# Altium schematic sheet Power.SchDoc
size 259 x 167 mm; SheetNumber: 2; SheetTotal: 2
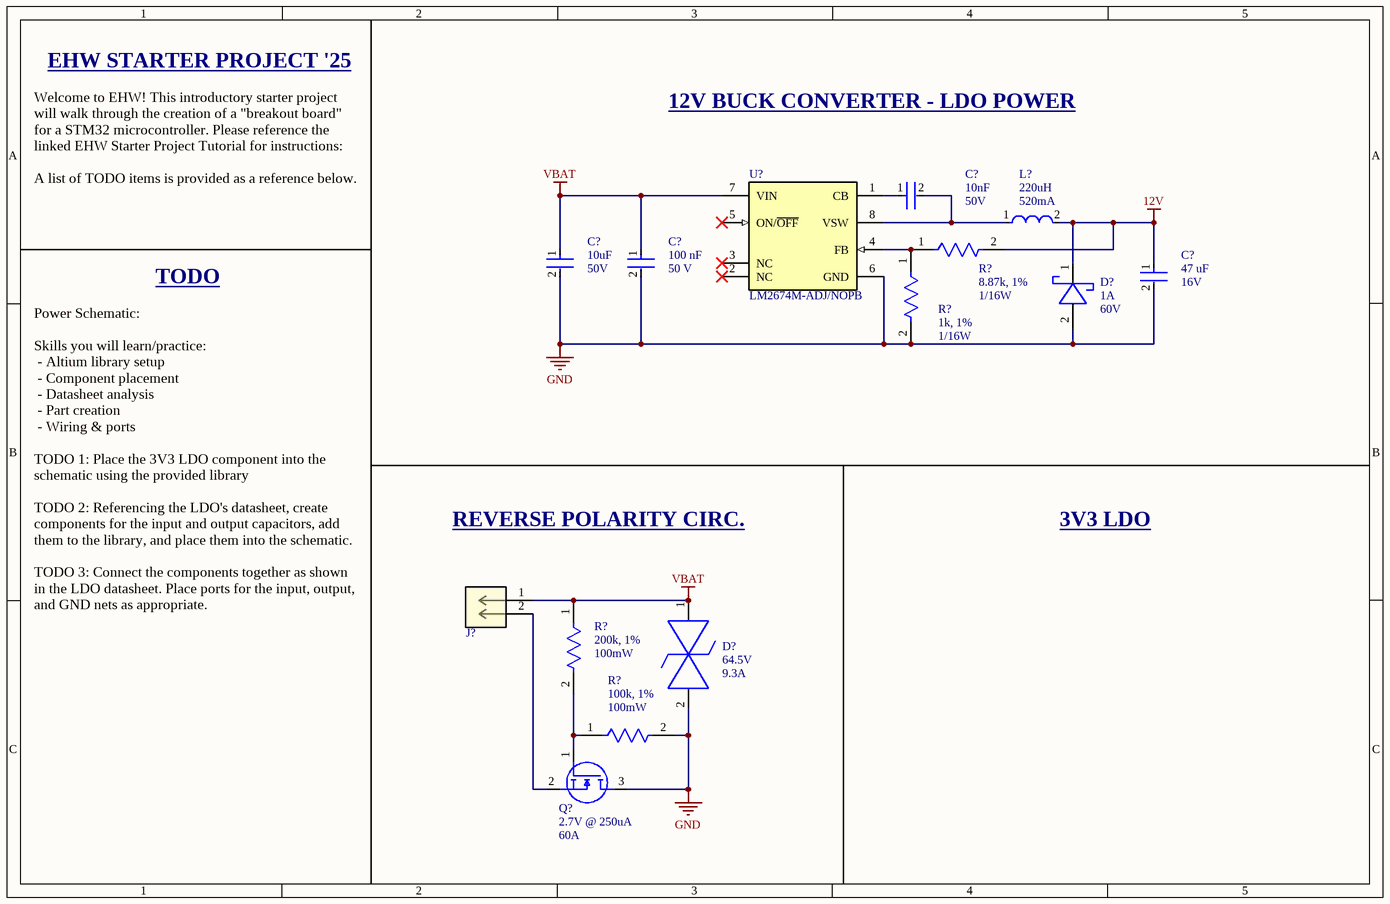
[diagram p0: Power.SchDoc]

## Parts
(Parts that share a designator on the sheet are numbered #1, #2 ... from top to bottom, then left to right.)
C?#1  Voltage Rating (DC): 50V  Capacitance: 10nF  [FP-GRM219-0_1-MFG]  (hidden comment: GRM2195C1H103JA01D)
C?#2  Voltage Rating (DC): 50V  Capacitance: 10uF  [FP-CL32-IPC_B]  (hidden comment: CL32B106KBJNNNE)
C?#3  Voltage Rating: 50 V  Capacitance: 100 nF  [FP-CC0805-0_85-MFG]  (hidden comment: CC0805KRX7R9BB104)
C?#4  Capacitance: 47 uF  Voltage: 16V  [FP-GRM32E-0_3-0_2-MFG]  (hidden comment: GRM32ER61C476KE15L)
D?#1  Forward Current: 1A  Reverse Voltage (DC): 60V  [SDO_SOD123F_NEX]  (hidden comment: PMEG6010CEH,115)
D?#2  Clamping Voltage: 64.5V  Current: 9.3A  [SMB]  (hidden comment: SMBJ40CA)
J?  Molex 0436500215  [CON_436500215_MOL]  (value not drawn)
L?  Inductance: 220uH  Current Rating: 520mA  [IND-220UH-0001]  (hidden comment: CDRH104NP-221MC)
Q?  Vgs: 2.7V @ 250uA  Drain Current: 60A  [FP-DNH0008A-MFG]  (hidden comment: CSD18543Q3AT)
R?#1  Power: 1/16W  Resistance: 1k, 1%  [RESC1005X40X25NL05T10]  (hidden comment: RC0402FR-071KL)
R?#2  Resistance: 8.87k, 1%  Power: 1/16W  [RESC1005X40X25NL05T10]  (hidden comment: RC0402FR-078K87L)
R?#3  Power: 100mW  Resistance: 200k, 1%  [FP-RC0603-0_55-IPC_B]  (hidden comment: RC0603FR-07200KL)
R?#4  Power: 100mW  Resistance: 100k, 1%  [FP-RC0603-0_55-IPC_B]  (hidden comment: RC0603FR-07100KL)
U?  LM2674M-ADJ/NOPB  [D0008A_N]

## Nets
12V: C?#4.1 D?#1.1(ANODE) L?.2 R?#2.2
GND: C?#2.2 C?#3.2 C?#4.2 D?#1.2(CATHODE) D?#2.2 Q?.3(D) R?#1.2 R?#4.2 U?.6(GND)
VBAT: C?#2.1 C?#3.1 D?#2.1 J?.1 R?#3.1 U?.7(VIN)
NetC?#1_1: C?#1.1 U?.1(CB)
NetC?#1_2: C?#1.2 L?.1 U?.8(VSW)
NetJ?_2: J?.2 Q?.2(S)
NetQ?_1: Q?.1(G) R?#3.2 R?#4.1
NetR?#1_1: R?#1.1 R?#2.1 U?.4(FB)

Not connected (* = marked no-connect by the designer): U? 2(NC)* 3(NC)* 5(ON/~{OFF})*

## Notes on the sheet
- EHW STARTER PROJECT '25
- 12V BUCK CONVERTER - LDO POWER
- Welcome to EHW! This introductory starter project will walk through the creation of a "breakout board" for a STM32 microcontroller. Please reference the linked EHW Starter Project Tutorial for instructions:
  A list of TODO items is provided as a reference below.
- TODO
- REVERSE POLARITY CIRC.
- 3V3 LDO
- Power Schematic:
  Skills you will learn/practice:
  - Altium library setup
  - Component placement
  - Datasheet analysis
  - Part creation
  - Wiring & ports
  TODO 1: Place the 3V3 LDO component into the schematic using the provided library
  TODO 2: Referencing the LDO's datasheet, create components for the input and output capacitors, add them to the library, and place them into the schematic.
  TODO 3: Connect the components together as shown in the LDO datasheet. Place ports for the input, output, and GND nets as appropriate.

## Library data of the parts
C?#1 = CAP-10N-0001: CAP CER 10000PF 50V C0G/NP0 0805; Dielectric Material: Ceramic; Dielectric: C0G; Insulation Resistance: 10GR; Tolerance: 5%; Temperature Coefficient: 30ppm/°C; Max Operating Temperature: 125°C; Height: 0.85mm; Voltage: 50V; Voltage Rating: 50V; Thickness: 0.037inch; REACH SVHC: No SVHC; Lead Free: Lead Free; Depth: 1.25mm; Min Operating Temperature: -55°C; Package Quantity: 1; Packaging: Tape and Reel; Case Code (Imperial): 0805; Case/Package: 0805; Mount: Surface Mount; Width: 0.049inch; Case Code (Metric): 2012; Length: 2mm; Termination: SMD/SMT; Material: Ceramic; Number of Pins: 2; Radiation Hardening: No
C?#2 = CAP-10U-0002: CAP CER 10UF 50V X7R 1210; Tolerance: 10%; Material: Ceramic; Min Operating Temperature: -55°C; Depth: 2.5mm; Radiation Hardening: No; Packaging: Tape and Reel; Dielectric: X7R; Case Code (Metric): 3225; Height: 2.5mm; Thickness: 0.106inch; Voltage Rating: 50V; Width: 0.098inch; Case Code (Imperial): 1210; Length: 3.2mm; Lead Free: Lead Free; Package Quantity: 1; Voltage: 50V; Mount: Surface Mount; Case/Package: 1210; Max Operating Temperature: 125°C
C?#3 = CAP-0.1U-0002: CAP CER 0.1UF 50V X7R 0805; Manufacturer: Yageo; Tolerance: 0.1; Value: 100 nF; Material: Ceramic; Device Class L1: Passive Components; ComponentLink2Description: Datasheet; Package: CC0805-0.85; Manufacturer Part Number: CC0805KRX7R9BB104; Digikey Description: CAP CER 0.1UF 50V X7R 0805; Device Class L3: Ceramic Capacitors; Temperature: -30°C to +85°C; Temperature Characteristic: X7R; Height: 0.95mm; RoHS: TRUE; Ipc Land Pattern Name: CAPC200125X85; Device Class L2: Capacitors; Category: Cap; Temperature Range Low: -30°C; Temperature Range High: +85°C; Mouser Description: Multilayer Ceramic Capacitors MLCC - SMD/SMT 100nF 50V X7R 10%; Footprint Url: http://www.yageo.com/exep/pages/download/literatures/UPY-C_GEN_24.pdf; Automotive: No; Octopart: https://octopart.com/cc0805krx7r9bb104-yageo-192993; Lead Free: Yes; ComponentLink2URL: http://www.yageo.com/documents/recent/UPY-GPHC_Y5V_6.3V-to-50V_8.pdf
C?#4 = CAP-47U-0002: CAP CER 47UF 16V X5R 1210; Tolerance: 10%; Material: Ceramic; RoHS Compliant: Yes; Min Operating Temperature: -55°C; Radiation Hardening: No; Package Quantity: 1; Case Code (Imperial): 1210; REACH SVHC: No SVHC; Voltage Rating (DC): 16V; Dielectric: X5R; Case/Package: 1210; Length: 3.2mm; Voltage Rating: 16V; Packaging: Cut Tape; Width: 0.098inch; Number of Pins: 2; Lead Free: Lead Free; Height: 2.5mm; Mount: Surface Mount; Termination: SMD/SMT; Max Operating Temperature: 85°C; Thickness: 0.106inch; Depth: 2.5mm; Case Code (Metric): 3225
D?#1 = DIO-SHOTTKY-0002: Diode 60 V 1A Surface Mount SOD-123F; Mfr_Name: Nexperia
D?#2 = DIO-TVS-0001: TVS DIODE 40VWM 64.5VC DO214AA; Mfr_Name: Bourns Electronics
J? = CONN-BATT-0001: Connector Header Through Hole 2 position 0.118" (3.00mm); Mfr_Name: Molex Connector Corporation; RefDes: RefDes; Type: Type
L? = IND-220U-0001: FIXED IND 220UH 520MA 960MOHM SM
Q? = NMOS-60A-0001: MOSFET N-CH 60V 12A/60A 8VSON; pin to pad: 1-3>1+2+3 5-8>5-6-7-8; Manufacturer: Texas Instruments; Turn On Delay Time: 9ns; Number Of Channels: 1; Reverse Recovery Charge: 37nC; Continuous Drain Current: 12A; Pulse Drain Current: 156A; Typ Forward Diode Voltage: 0.8V; Gate Charge At Vgs: 11.1nC @ 10V; Depletion Mode: False; Transconductance: 40S; Threshold Vgs Min: 1.5V; Max Forward Diode Voltage: 1V; Turn Off Delay Time: 8ns; Threshold Vgs Max: 2.7V; Power Dissipation: 2.8W; Max Junction Temp: +150°C; Reverse Recovery Time: 27ns; Drain To Source Resistance: 8.1mΩ; Standoff Height: 0mm; Rthja Max: 55°C/W; Input Capacitace At Vds: 885pF @ 30V; Gate To Source Voltage: 20V; Device Class L1: Discrete Semiconductors; ComponentLink2Description: Datasheet; Drain To Source Voltage: 60V; Mouser Description: Transistor: N-MOSFET; unipolar; 60V; 35A; 66W; VSONP8 3, 3x3, 3mm; RoHS: TRUE; Manufacturer Part Number: CSD18543Q3AT; Digikey Description: 60V N-CHANNEL NEXFET POWER MOSF; Lead Free: Yes; Height: 0.9mm; Device Class L3: MOSFETs; Number Of N Channels: 1; Drain To Source Breakdown Voltage: 60V; Category: Trans; Automotive: No; Package: DNH0008A; Octopart: https://octopart.com/csd18543q3at-texas+instruments-77040189; Temperature Range Low: -55°C; Device Class L2: Transistors; Temperature: -55°C to +150°C; Temperature Range High: +150°C; ComponentLink2URL: http://www.ti.com/lit/ds/symlink/csd18543q3a.pdf
R?#1 = RES-1k-0001: RES 1K OHM 1% 1/16W 0402; Max Power Dissipation: 63mW; Voltage Rating (DC): 50V; Temperature Coefficient: 100ppm/°C; Power Rating: 62.5mW; Technology: THICK FILM; Size Code: 0402; Series: RC; Length: 1mm; Case/Package: 0402; Features: Moisture Resistant; Termination: SMD/SMT; Case Code (Metric): 1005; Reach SVHC Compliant: Yes; Number of Terminations: 2; Tolerance: 1%; Lead Free: Lead Free; Military Standard: Not; Resistor Type: Thick Film; Max Operating Temperature: 155°C; RoHS Compliant: Yes; Construction: Rectangular; Voltage Rating: 50V; Packaging: Tape and Reel; Height: 0.32mm; Number of Pins: 2; Resistance Tolerance: 1%; Case Code (Imperial): 0402; Depth: 0.5mm; Min Operating Temperature: -55°C; Width: 0.5mm
R?#2 = RES-8.87k-0001: RES 8.87K OHM 1% 1/16W 0402; Manufacturer: Yageo / Phycomp; Part Number: RC0402FR-078K87L
R?#3 = RES-200k-0001: RES SMD 200K OHM 1% 1/10W 0603; Temperature Coefficient: 100ppm/°C; Voltage Rating: 50V; Packaging: Tape and Reel; REACH SVHC: No SVHC; Resistance Tolerance: 1%; Number of Pins: 2; Width: 0.031inch; Termination: SMD/SMT; Features: Moisture Resistant; Tolerance: 1%; Series: RC; Case Code (Imperial): 0603; Depth: 0.8mm; Number of Terminations: 2; Max Operating Temperature: 155°C; Resistor Type: Thick Film; Height: 0.022inch; Lead Free: Lead Free; Construction: Rectangular; Case/Package: 0603; Max Power Dissipation: 100mW; Power Rating: 100mW; Case Code (Metric): 1608; Length: 1.6mm; Size Code: 0603; RoHS Compliant: Yes; Military Standard: Not; Min Operating Temperature: -55°C; Package Quantity: 1; Voltage Rating (DC): 50V
R?#4 = RES-100k-0001: RES SMD 100K OHM 1% 1/10W 0603; Voltage Rating (DC): 50V; Temperature Coefficient: 100ppm/°C; Working Voltage: 75V; Length: 1.6mm; Lead Free: Lead Free; Number of Terminations: 2; Packaging: Tape and Reel; Voltage Rating: 50V; Termination: SMD/SMT; Width: 0.8mm; Resistor Type: Thick Film; Max Power Dissipation: 100mW; Resistance Tolerance: 1%; Features: Moisture Resistant; Height: 0.45mm; Construction: Rectangular; Case/Package: 0603; Military Standard: Not; Case Code (Imperial): 0603; Series: RC; Technology: THICK FILM; Depth: 0.8mm; RoHS Compliant: Yes; REACH SVHC: No SVHC; Min Operating Temperature: -55°C; Case Code (Metric): 1608; Max Operating Temperature: 155°C; Power Rating: 100mW; Number of Pins: 2; Tolerance: 1%
U? = IC-BUCK-0002: IC REG BUCK ADJ 500MA 8SOIC; Manufacturer: Texas Instruments; PackageTopMarking: NSZXTT*2674*MADJ; CompType: Switcher; PowerWise: N; ComponentLink1Description: Datasheet URL; PinCount: 8; RoHS: Y; ComponentLink1URL: http://www.ti.com/general/docs/lit/getliterature.tsp?genericPartNumber=LM2674&fileType=pdf; Code_IPC: SOIC127P600-8; PackageReference: D0008A; PackageDescription: SOIC Narrow, 4.9 x 3.9 x 1.45mm, 8 Lead, 1.27mm Pitch; Code_JEDEC: MS-012-AA